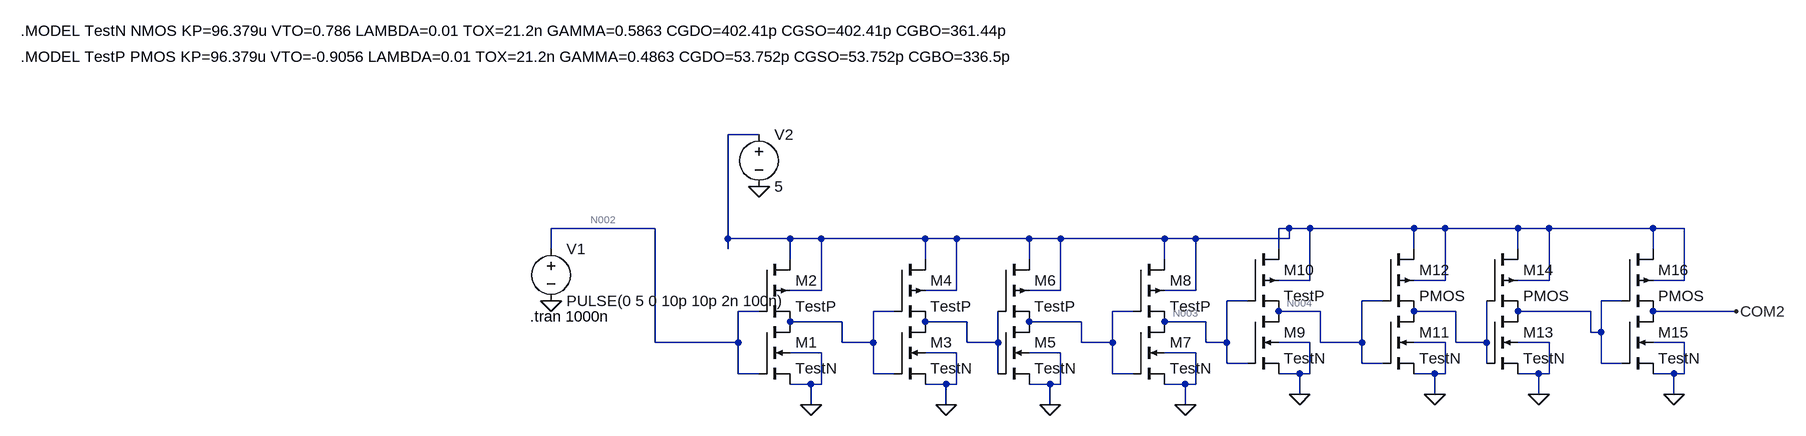
[diagram p0: schematic exp4_VcoSimulation.asc]
exp4_VcoSimulation.asc, the LTspice schematic file:
Version 4
SHEET 1 1412 720
WIRE -176 -208 -224 -208
WIRE -336 -64 -496 -64
WIRE 640 -64 624 -64
WIRE 672 -64 640 -64
WIRE 832 -64 672 -64
WIRE 880 -64 832 -64
WIRE 992 -64 880 -64
WIRE 1040 -64 992 -64
WIRE 1200 -64 1040 -64
WIRE 1248 -64 1200 -64
WIRE -224 -48 -224 -208
WIRE -128 -48 -224 -48
WIRE -80 -48 -128 -48
WIRE 80 -48 -80 -48
WIRE 128 -48 80 -48
WIRE 240 -48 128 -48
WIRE 288 -48 240 -48
WIRE 448 -48 288 -48
WIRE 496 -48 448 -48
WIRE 640 -48 640 -64
WIRE 640 -48 496 -48
WIRE -496 -32 -496 -64
WIRE -224 -32 -224 -48
WIRE 624 -32 624 -64
WIRE 832 -32 832 -64
WIRE 992 -32 992 -64
WIRE 1200 -32 1200 -64
WIRE -128 -16 -128 -48
WIRE 80 -16 80 -48
WIRE 240 -16 240 -48
WIRE 448 -16 448 -48
WIRE 672 16 672 -64
WIRE 672 16 624 16
WIRE 880 16 880 -64
WIRE 880 16 832 16
WIRE 1040 16 1040 -64
WIRE 1040 16 992 16
WIRE 1248 16 1248 -64
WIRE 1248 16 1200 16
WIRE -80 32 -80 -48
WIRE -80 32 -128 32
WIRE 128 32 128 -48
WIRE 128 32 80 32
WIRE 288 32 288 -48
WIRE 288 32 240 32
WIRE 496 32 496 -48
WIRE 496 32 448 32
WIRE 576 48 544 48
WIRE 784 48 752 48
WIRE 1152 48 1120 48
WIRE -176 64 -208 64
WIRE 32 64 0 64
WIRE 400 64 368 64
WIRE 688 64 624 64
WIRE 896 64 832 64
WIRE 1104 64 992 64
WIRE 1328 64 1200 64
WIRE -48 80 -128 80
WIRE 144 80 80 80
WIRE 320 80 240 80
WIRE 512 80 448 80
WIRE 1104 96 1104 64
WIRE 1120 96 1120 48
WIRE 1120 96 1104 96
WIRE -336 112 -336 -64
WIRE -208 112 -208 64
WIRE -208 112 -336 112
WIRE -48 112 -48 80
WIRE 0 112 0 64
WIRE 0 112 -48 112
WIRE 144 112 144 80
WIRE 192 112 192 64
WIRE 192 112 144 112
WIRE 320 112 320 80
WIRE 368 112 368 64
WIRE 368 112 320 112
WIRE 512 112 512 80
WIRE 544 112 544 48
WIRE 544 112 512 112
WIRE 672 112 624 112
WIRE 688 112 688 64
WIRE 752 112 752 48
WIRE 752 112 688 112
WIRE 880 112 832 112
WIRE 896 112 896 64
WIRE 944 112 944 48
WIRE 944 112 896 112
WIRE 1040 112 992 112
WIRE 1248 112 1200 112
WIRE -80 128 -128 128
WIRE 128 128 80 128
WIRE 288 128 240 128
WIRE 496 128 448 128
WIRE 544 144 544 112
WIRE 576 144 544 144
WIRE 752 144 752 112
WIRE 784 144 752 144
WIRE 944 144 944 112
WIRE 1120 144 1120 96
WIRE 1152 144 1120 144
WIRE -208 160 -208 112
WIRE -176 160 -208 160
WIRE 0 160 0 112
WIRE 32 160 0 160
WIRE 192 160 192 112
WIRE 368 160 368 112
WIRE 400 160 368 160
WIRE 656 160 624 160
WIRE 672 160 672 112
WIRE 672 160 656 160
WIRE 864 160 832 160
WIRE 880 160 880 112
WIRE 880 160 864 160
WIRE 1024 160 992 160
WIRE 1040 160 1040 112
WIRE 1040 160 1024 160
WIRE 1232 160 1200 160
WIRE 1248 160 1248 112
WIRE 1248 160 1232 160
WIRE -96 176 -128 176
WIRE -80 176 -80 128
WIRE -80 176 -96 176
WIRE 112 176 80 176
WIRE 128 176 128 128
WIRE 128 176 112 176
WIRE 272 176 240 176
WIRE 288 176 288 128
WIRE 288 176 272 176
WIRE 480 176 448 176
WIRE 496 176 496 128
WIRE 496 176 480 176
WIRE 656 192 656 160
WIRE 864 192 864 160
WIRE 1024 192 1024 160
WIRE 1232 192 1232 160
WIRE -96 208 -96 176
WIRE 112 208 112 176
WIRE 272 208 272 176
WIRE 480 208 480 176
FLAG -496 48 0
FLAG -176 -128 0
FLAG 1328 64 COM2
FLAG -96 208 0
FLAG 112 208 0
FLAG 272 208 0
FLAG 480 208 0
FLAG 656 192 0
FLAG 864 192 0
FLAG 1024 192 0
FLAG 1232 192 0
SYMBOL voltage -496 -48 R0
WINDOW 123 0 0 Left 0
WINDOW 39 0 0 Left 0
SYMATTR InstName V1
SYMATTR Value PULSE(0 5 0 10p 10p 2n 100n)
SYMBOL voltage -176 -224 R0
WINDOW 123 0 0 Left 0
WINDOW 39 0 0 Left 0
SYMATTR InstName V2
SYMATTR Value 5
SYMBOL nmos4 -176 80 R0
SYMATTR InstName M1
SYMATTR Value TestN
SYMATTR Value2 l=10u w=20u
SYMBOL pmos4 -176 -16 R0
SYMATTR InstName M2
SYMATTR Value TestP
SYMATTR Value2 l=10u w=40u
SYMBOL nmos4 32 80 R0
SYMATTR InstName M3
SYMATTR Value TestN
SYMATTR Value2 l=10u w=20u
SYMBOL pmos4 32 -16 R0
SYMATTR InstName M4
SYMATTR Value TestP
SYMATTR Value2 l=10u w=40u
SYMBOL nmos4 192 80 R0
SYMATTR InstName M5
SYMATTR Value TestN
SYMATTR Value2 l=10u w=20u
SYMBOL pmos4 192 -16 R0
SYMATTR InstName M6
SYMATTR Value TestP
SYMATTR Value2 l=10u w=40u
SYMBOL nmos4 400 80 R0
SYMATTR InstName M7
SYMATTR Value TestN
SYMATTR Value2 l=10u w=20u
SYMBOL pmos4 400 -16 R0
SYMATTR InstName M8
SYMATTR Value TestP
SYMATTR Value2 l=10u w=40u
SYMBOL nmos4 576 64 R0
SYMATTR InstName M9
SYMATTR Value TestN
SYMATTR Value2 l=10u w=20u
SYMBOL pmos4 576 -32 R0
SYMATTR InstName M10
SYMATTR Value TestP
SYMATTR Value2 l=10u w=40u
SYMBOL nmos4 784 64 R0
SYMATTR InstName M11
SYMATTR Value TestN
SYMATTR Value2 l=10u w=20u
SYMBOL pmos4 784 -32 R0
SYMATTR InstName M12
SYMBOL nmos4 944 64 R0
SYMATTR InstName M13
SYMATTR Value TestN
SYMATTR Value2 l=10u w=20u
SYMBOL pmos4 944 -32 R0
SYMATTR InstName M14
SYMBOL nmos4 1152 64 R0
SYMATTR InstName M15
SYMATTR Value TestN
SYMATTR Value2 l=10u w=20u
SYMBOL pmos4 1152 -32 R0
SYMATTR InstName M16
TEXT -1312 -368 Left 2 !.MODEL TestN NMOS KP=96.379u VTO=0.786 LAMBDA=0.01 TOX=21.2n GAMMA=0.5863 CGDO=402.41p CGSO=402.41p CGBO=361.44p
TEXT -1312 -328 Left 2 !.MODEL TestP PMOS KP=96.379u VTO=-0.9056 LAMBDA=0.01 TOX=21.2n GAMMA=0.4863 CGDO=53.752p CGSO=53.752p CGBO=336.5p
TEXT -528 72 Left 2 !.tran 1000n

The netlist it stands for:
* exp4_VcoSimulation.asc
V1 N002 0 PULSE(0 5 0 10p 10p 2n 100n)
V2 N001 0 5
M1 N006 N002 0 0 TestN l=10u w=20u
M2 N001 N002 N006 N001 TestP l=10u w=40u
M3 N009 N006 0 0 TestN l=10u w=20u
M4 N001 N006 N009 N001 TestP l=10u w=40u
M5 N007 N009 0 0 TestN l=10u w=20u
M6 N001 N009 N007 N001 TestP l=10u w=40u
M7 N003 N007 0 0 TestN l=10u w=20u
M8 N001 N007 N003 N001 TestP l=10u w=40u
M9 N004 N003 0 0 TestN l=10u w=20u
M10 N001 N003 N004 N001 TestP l=10u w=40u
M11 N008 N004 0 0 TestN l=10u w=20u
M12 N001 N004 N008 N001 PMOS
M13 N005 N008 0 0 TestN l=10u w=20u
M14 N001 N008 N005 N001 PMOS
M15 COM2 N005 0 0 TestN l=10u w=20u
M16 N001 N005 COM2 N001 PMOS
.model NMOS NMOS
.model PMOS PMOS
.lib standard.mos
.MODEL TestN NMOS KP=96.379u VTO=0.786 LAMBDA=0.01 TOX=21.2n GAMMA=0.5863 CGDO=402.41p CGSO=402.41p CGBO=361.44p
.MODEL TestP PMOS KP=96.379u VTO=-0.9056 LAMBDA=0.01 TOX=21.2n GAMMA=0.4863 CGDO=53.752p CGSO=53.752p CGBO=336.5p
.tran 1000n
.backanno
.end

* Results of the author's LTspice run, read from the files saved beside the schematic
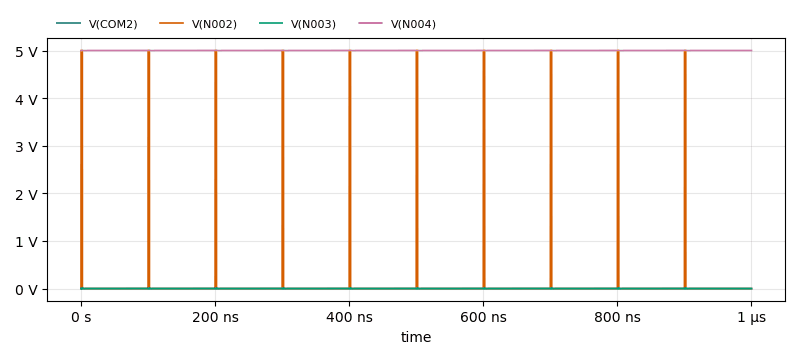
[diagram p1: Transient Analysis of exp4_VcoSimulation.asc, plotted from the saved traces]
* Transient Analysis, 1 run:
*   V(COM2): min -12.95 µV, max 14.63 µV, average 8.174 nV, rms 817.5 nV, last 12.32 nV
*   V(N002): min 0 V, max 5 V, average 100.5 mV, rms 708.3 mV, last 0 V
*   V(N003): min -4.895 mV, max 12.37 mV, average -306.2 nV, rms 1.218 mV, last 12.32 nV
*   V(N004): min 4.998 V, max 5.003 V, average 5 V, rms 5 V, last 5 V